# EAGLE design CAPT-A1-01 Cap Touch Slider FeatherWing (EAGLE 9.4.2)
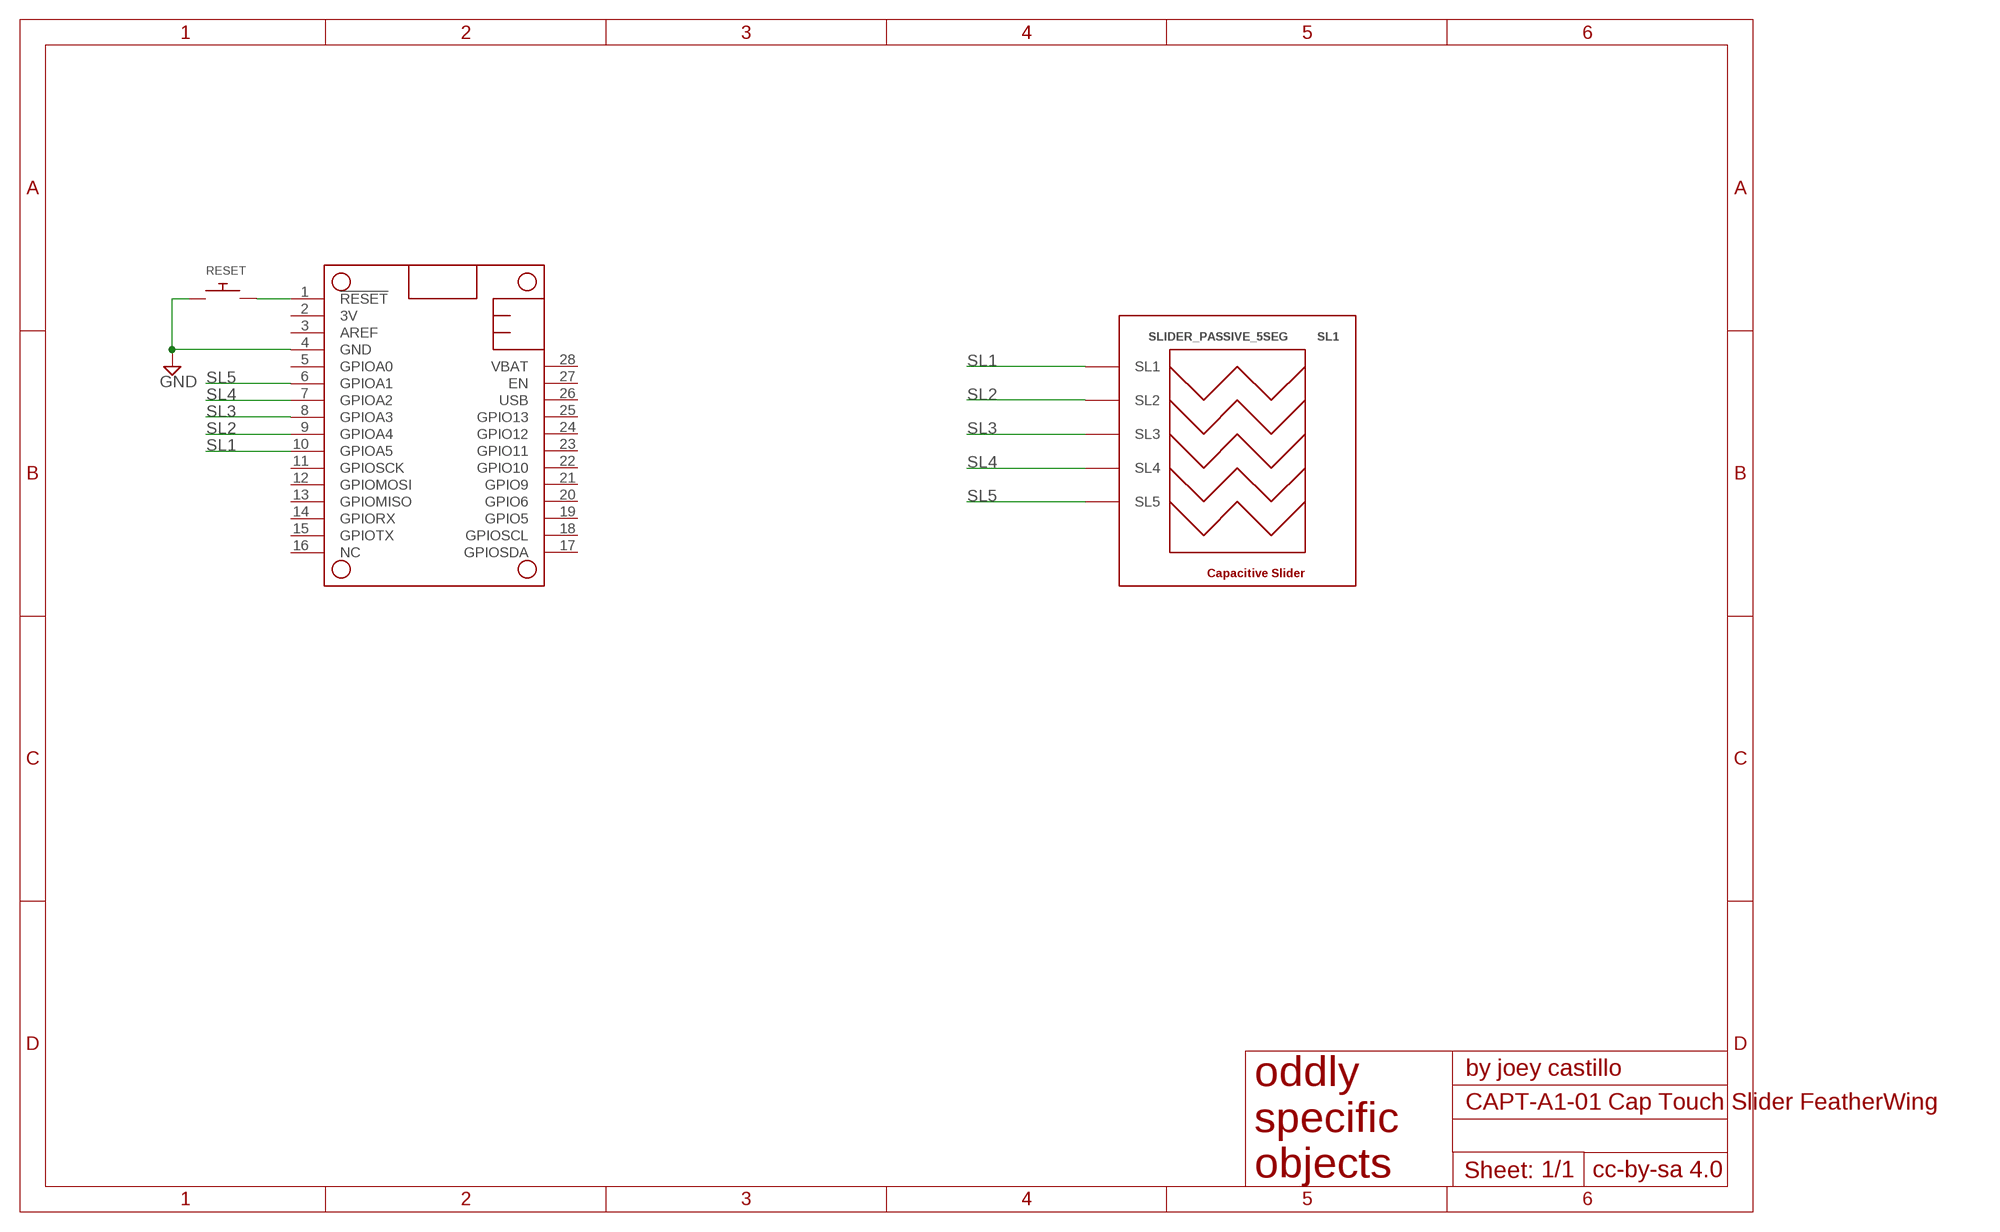
[diagram p0: schematic, sheet 1]

## Parts
MS1  FEATHERWING  [FEATHERWING]
RESET  SPST_TACTILE_SWITCHRA-THRU  [MJTP1117]
SL1  SLIDER_PASSIVE_5SEG  [SLIDER_PASSIVE_5SEG_12MM]

## Nets
!RESET: MS1.1(!RESET) RESET.P$2
GND: MS1.4(GND) RESET.P$1
SL1: MS1.10(GPIOA5) SL1.SL1
SL2: MS1.9(GPIOA4) SL1.SL2
SL3: MS1.8(GPIOA3) SL1.SL3
SL4: MS1.7(GPIOA2) SL1.SL4
SL5: MS1.6(GPIOA1) SL1.SL5
Unconnected: MS1.2(3V) MS1.3(AREF) MS1.5(GPIOA0) MS1.11(GPIOSCK) MS1.12(GPIOMOSI) MS1.13(GPIOMISO) MS1.14(GPIORX) MS1.15(GPIOTX) MS1.16(NC) MS1.17(GPIOSDA) MS1.18(GPIOSCL) MS1.19(GPIO5) MS1.20(GPIO6) MS1.21(GPIO9) MS1.22(GPIO10) MS1.23(GPIO11) MS1.24(GPIO12) MS1.25(GPIO13) MS1.26(USB) MS1.27(EN) MS1.28(VBAT)

## Library data of the parts
MS1 = microbuilder:FEATHERWING
RESET = My Stuff:SPST_TACTILE_SWITCH
SL1 = PatternAgents-TouchWidgets:SLIDER_PASSIVE_5SEG: Slider, Passive Touch/Capacitive Sensing Type, Five (5) Segment Source : http://www.PatternAgents.com Github : https://github.com/PatternAgents License : http://creativecommons.org/licenses/by-sa/3.1/ (Creative Commons 3.1) THIS SOFTWARE IS PROVIDED BY THE CONTRIBUTORS "AS IS" AND WITHOUT ANY EXPRESS OR IMPLIED WARRANTIES, INCLUDING, BUT NOT LIMITED TO, THE IMPLIED WARRANTIES OF MERCHANTABILITY AND FITNESS FOR A PARTICULAR PURPOSE ARE DISCLAIMED. IN NO EVENT SHALL THE COPYRIGHT OWNER OR CONTRIBUTORS BE LIABLE FOR ANY DIRECT, INDIRECT, INCIDENTAL, SPECIAL, EXEMPLARY, OR CONSEQUENTIAL DAMAGES (INCLUDING, BUT NOT LIMITED TO, PROCUREMENT OF SUBSTITUTE GOODS OR SERVICES; LOSS OF USE, DATA, OR PROFITS; OR BUSINESS INTERRUPTION) HOWEVER CAUSED AND ON ANY THEORY OF LIABILITY, WHETHER IN CONTRACT, STRICT LIABILITY, OR TORT (INCLUDING NEGLIGENCE OR OTHERWISE) ARISING IN ANY WAY OUT OF THE USE OF THIS SOFTWARE, EVEN IF ADVISED OF THE POSSIBILITY OF SUCH DAMAGE.

## Board
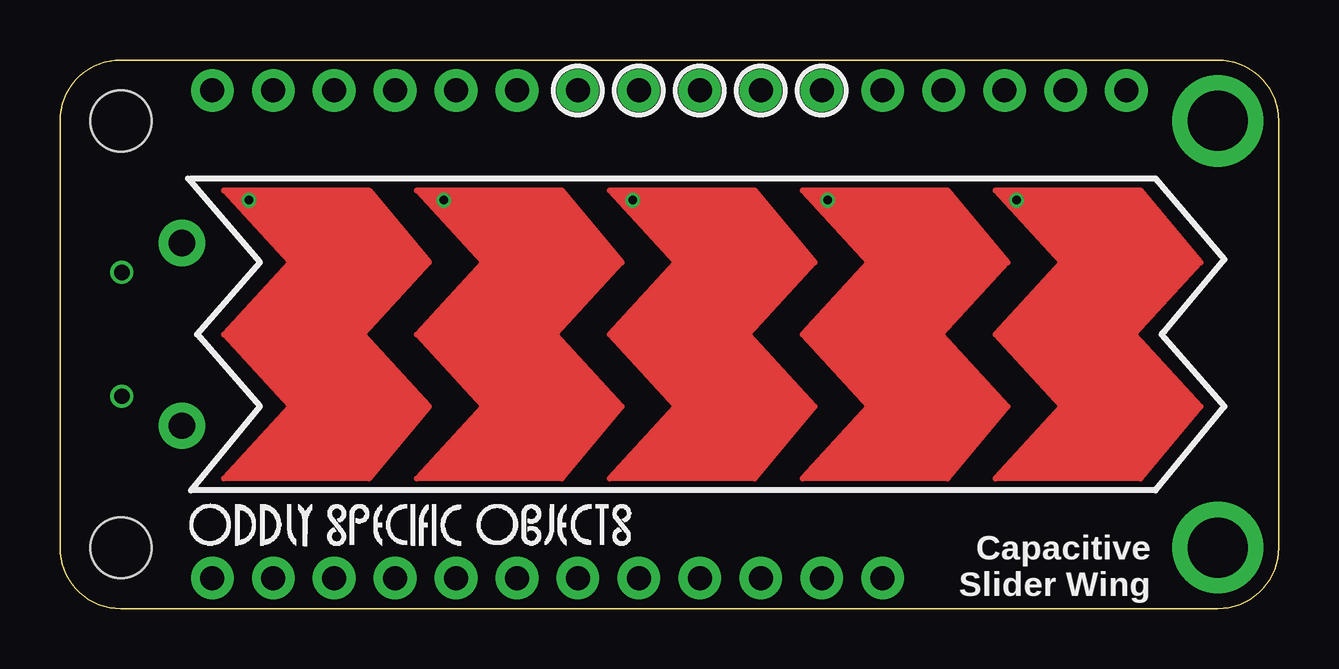
[diagram p1: board, top side]
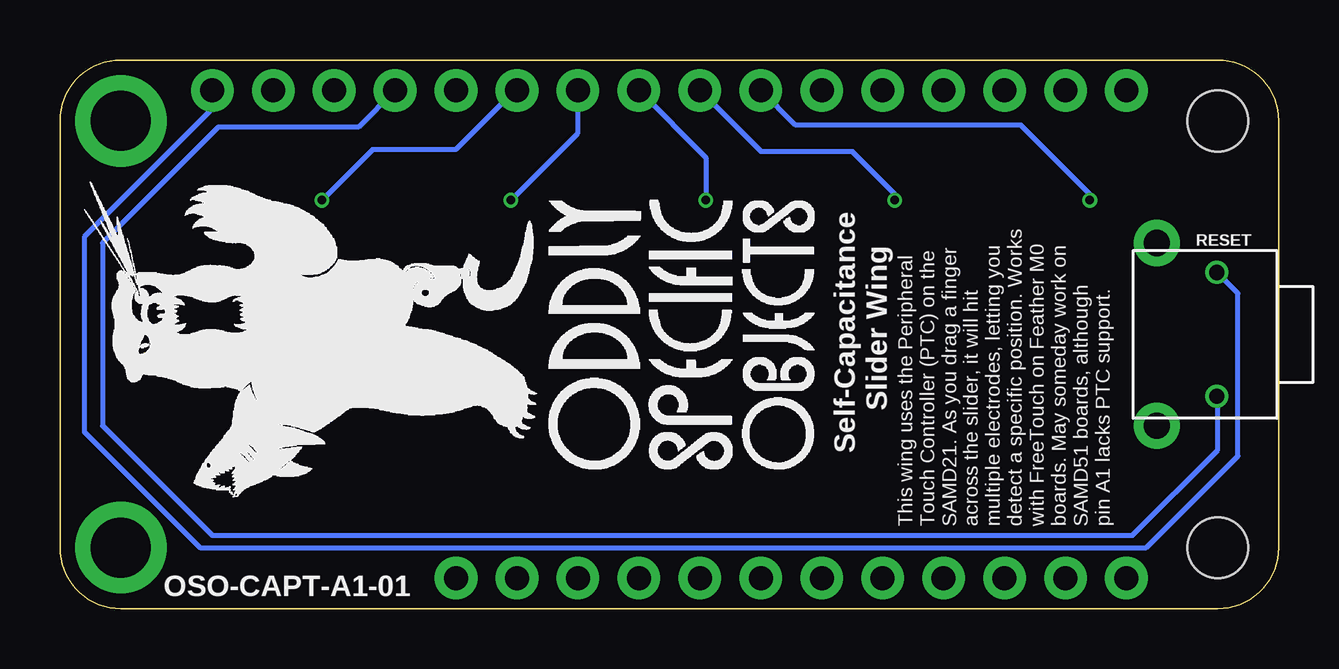
[diagram p2: board, bottom side, seen from below]

Size 50.8 x 22.86 mm. Coordinates in mm from the lower left corner, seen from the top.
Outline: 48.26,0 2.54,0 arc-90 0,2.54 0,20.32 arc-90 2.54,22.86 48.26,22.86 arc-90 50.8,20.32 50.8,2.54 arc-90 48.26,0
Copper layers (1*16): Top 0.035559375mm / dielectric 1.6mm / Bottom 0.035559375mm
Design rules "oshpark-2layer": minimum track width 6mil, minimum drill 10mil, track to track 6mil, track to pad 6mil, pad to pad 6mil, via to via 6mil, smd to smd 6mil, copper to edge 15mil, drill to drill 6mil, minimum pad ring 5mil, minimum via ring 5mil, stop-mask expansion 2.5mil, vias tented up to drill 0mil, thermal gap 10mil

### Footprints (pad centres in the part's own frame; a part is rotated, then mirrored left to right if it is on the bottom)
FEATHERWING = drill 1 pad 1.778: 1 6.35,1.27; 2 8.89,1.27; 3 11.43,1.27; 4 13.97,1.27; 5 16.51,1.27; 6 19.05,1.27; 7 21.59,1.27; 8 24.13,1.27; 9 26.67,1.27; 10 29.21,1.27; 11 31.75,1.27; 12 34.29,1.27; 13 36.83,1.27; 14 39.37,1.27; 15 41.91,1.27; 16 44.45,1.27; 17 44.45,21.59; 18 41.91,21.59; 19 39.37,21.59; 20 36.83,21.59; 21 34.29,21.59; 22 31.75,21.59; 23 29.21,21.59; 24 26.67,21.59; 25 24.13,21.59; 26 21.59,21.59; 27 19.05,21.59; 28 16.51,21.59 | drill 2.5 pad 3.81: P$1 2.54,20.32; P$2 2.54,2.54 | hole 2.54: 48.26,20.32; 48.26,2.54
MJTP1117 = drill 0.635: P$1 -2.58,0.04; P$2 2.58,0.04 | drill 1.1 pad 1.93: P$5 -3.81,2.54; P$6 3.81,2.54
SLIDER_PASSIVE_5SEG_12MM = drill 0.356: SL1 -5.588,-13.462; SL2 -5.588,-5.334; SL3 -5.588,2.54; SL4 -5.588,10.668; SL5 -5.588,18.542

### Placement (x,y rotation side)
MS1  50.8,22.86 180 top
RESET  2.54,11.43 90 bottom
SL1  21.34,11.43 270 top
U$1  [OSO_WORDMARK_THREELINE_450MIL_1000DPI]  24.89,11.43 90 bottom
U$2  [OSO_BEAR_525X750MIL_1000DPI]  40.39,11.18 90 bottom
U$3  [OSO_WORDMARK_ONELINE_725MIL_1000DPI]  5.33,2.54 0 top

### Tracks (layer width: path | path; a pad name or v marks a point on that pad's centre or on a via)
!RESET
  Bottom 0.203: MS1.1 44.45,20.83 49.78,15.49 49.78,7.37 44.96,2.54 5.52,2.54 1.7,6.36 1.7,13.13 RESET.P$2
GND
  Bottom 0.203: MS1.4 38.35,20.07 44.2,20.07 49.02,15.24 49.02,7.62 44.45,3.05 6.1,3.05 2.54,6.6 2.54,8.81 RESET.P$1
SL1
  Bottom 0.203: SL1.SL1 7.87,17.27 10.74,20.14 20.14,20.14 MS1.10
SL2
  Bottom 0.203: MS1.9 21.59,19.05 17.78,19.05 16,17.27 SL1.SL2
SL3
  Bottom 0.203: MS1.8 23.88,18.8 SL1.SL3
SL4
  Bottom 0.203: SL1.SL4 29.21,19.81 MS1.7
SL5
  Bottom 0.203: SL1.SL5 37.77,19.13 34.3,19.13 31.84,21.59 MS1.6

### Text on the board
tPlace: Capacitive / Slider Wing
bPlace: RESET | Self-Capacitance / Slider Wing | This wing uses the Peripheral / Touch Controller (PTC) on the / SAMD21. As you drag a finger / across the slider, it will hit / multiple electrodes, letting you / detect a specific position. Works / with FreeTouch on Feather M0 / boards. May someday work on / SAMD51 boards, although / pin A1 lacks PTC support. | OSO-CAPT-A1-01